# Altium schematic sheet SC.schdoc: TEBF0808 - CPLD
size A4; DocumentNumber: TEBF0808; Revision: 04; SheetNumber: 26; SheetTotal: 36; Date: 2016-09-29; CompanyName: Trenz Electronic GmbH; Organization: Trenz Electronic GmbH
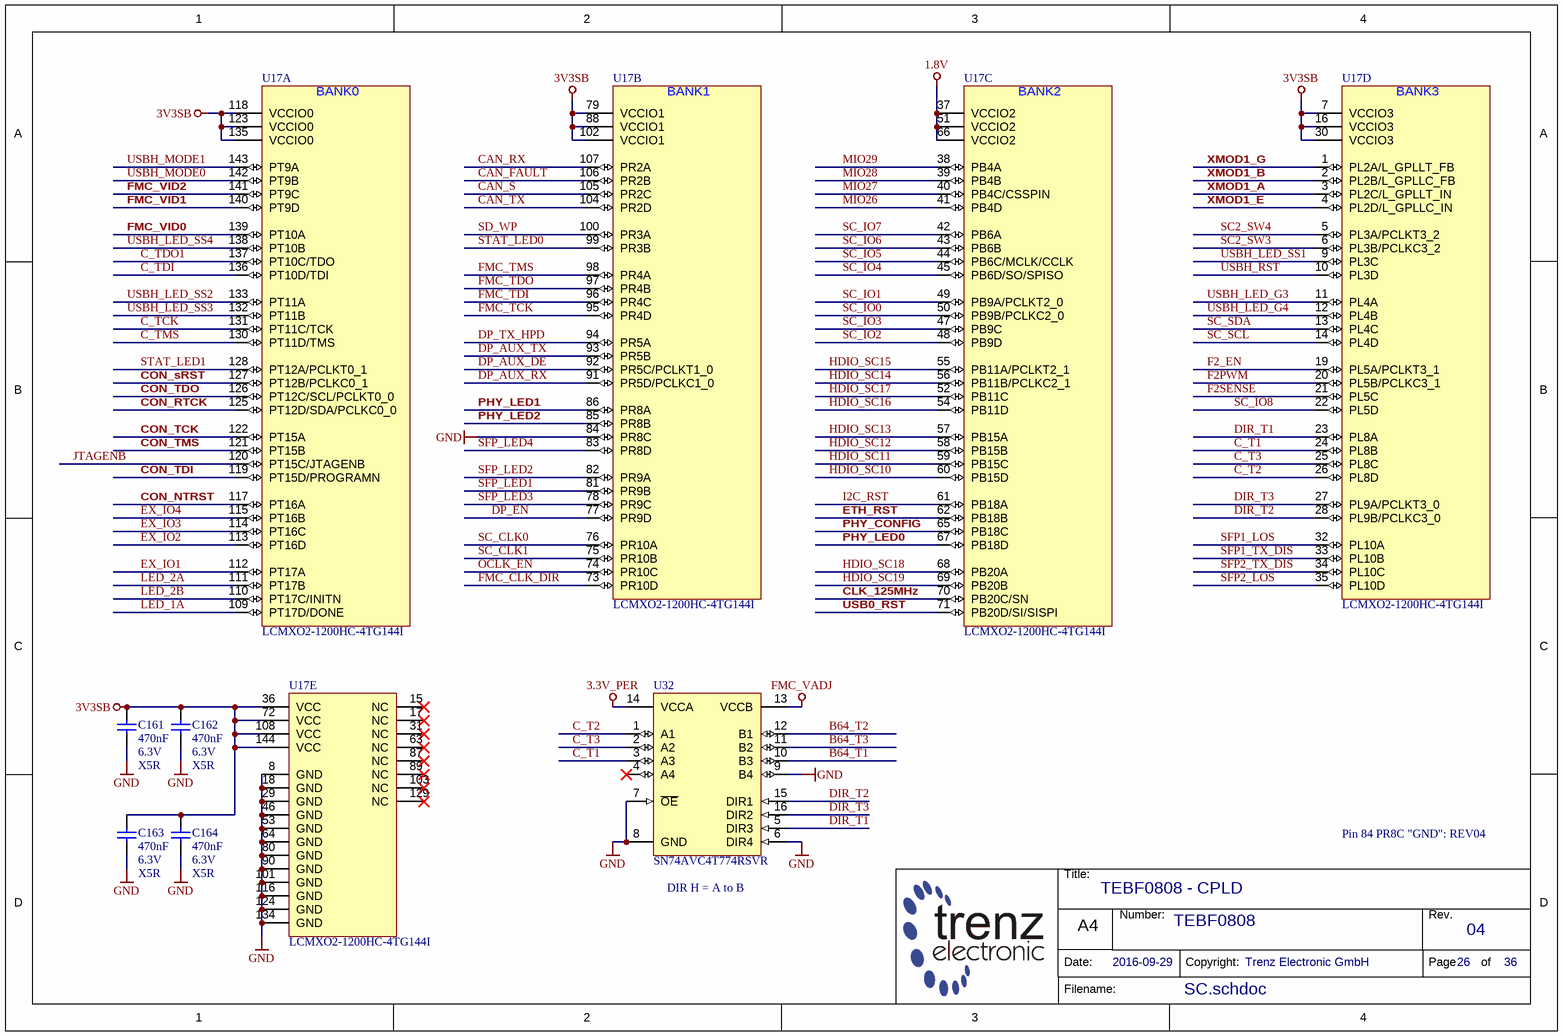
[diagram p0: SC.schdoc]

## Parts
C161  470nF  Voltage: 6.3V  Technology: X5R  [CAPC1005X55N]
C162  470nF  Voltage: 6.3V  Technology: X5R  [CAPC1005X55N]
C163  470nF  Voltage: 6.3V  Technology: X5R  [CAPC1005X55N]
C164  470nF  Voltage: 6.3V  Technology: X5R  [CAPC1005X55N]
U17  LCMXO2-1200HC-4TG144I  [QFP50P2200X2200X160-144N]  (parts A,B,C,D,E of 5)
U32  SN74AVC4T774RSVR  [QFN40P260X180X55-16N]

## Nets
1.8V: U17.37(VCCIO2) U17.51(VCCIO2) U17.66(VCCIO2)
3.3V_PER: U32.14(VCCA)
3V3SB: C161.1 C162.1 C163.1 C164.1 U17.7(VCCIO3) U17.16(VCCIO3) U17.30(VCCIO3) U17.36(VCC) U17.72(VCC) U17.79(VCCIO1) U17.88(VCCIO1) U17.102(VCCIO1) U17.108(VCC) U17.118(VCCIO0) U17.123(VCCIO0) U17.135(VCCIO0) U17.144(VCC)
FMC_VADJ: U32.13(VCCB)
GND: C161.2 C162.2 C163.2 C164.2 U17.8(GND) U17.18(GND) U17.29(GND) U17.46(GND) U17.53(GND) U17.64(GND) U17.80(GND) U17.84(PR8C) U17.90(GND) U17.101(GND) U17.116(GND) U17.124(GND) U17.134(GND) U32.6(DIR4) U32.7(~{OE}) U32.8(GND) U32.9(B4)
B64_T1: U32.10(B3)
B64_T2: U32.12(B1)
B64_T3: U32.11(B2)
C_T1: U17.24(PL8B) U32.3(A3)
C_T2: U17.26(PL8D) U32.1(A1)
C_T3: U17.25(PL8C) U32.2(A2)
C_TCK: U17.131(PT11C/TCK)
C_TDI: U17.136(PT10D/TDI)
C_TDO1: U17.137(PT10C/TDO)
C_TMS: U17.130(PT11D/TMS)
CAN_FAULT: U17.106(PR2B)
CAN_RX: U17.107(PR2A)
CAN_S: U17.105(PR2C)
CAN_TX: U17.104(PR2D)
CLK_125MHz: U17.70(PB20C/SN)
CON_NTRST: U17.117(PT16A)
CON_RTCK: U17.125(PT12D/SDA/PCLKC0_0)
CON_sRST: U17.127(PT12B/PCLKC0_1)
CON_TCK: U17.122(PT15A)
CON_TDI: U17.119(PT15D/PROGRAMN)
CON_TDO: U17.126(PT12C/SCL/PCLKT0_0)
CON_TMS: U17.121(PT15B)
DIR_T1: U17.23(PL8A) U32.5(DIR3)
DIR_T2: U17.28(PL9B/PCLKC3_0) U32.15(DIR1)
DIR_T3: U17.27(PL9A/PCLKT3_0) U32.16(DIR2)
DP_AUX_DE: U17.92(PR5C/PCLKT1_0)
DP_AUX_RX: U17.91(PR5D/PCLKC1_0)
DP_AUX_TX: U17.93(PR5B)
DP_EN: U17.77(PR9D)
DP_TX_HPD: U17.94(PR5A)
ETH_RST: U17.62(PB18B)
EX_IO1: U17.112(PT17A)
EX_IO2: U17.113(PT16D)
EX_IO3: U17.114(PT16C)
EX_IO4: U17.115(PT16B)
F2_EN: U17.19(PL5A/PCLKT3_1)
F2PWM: U17.20(PL5B/PCLKC3_1)
F2SENSE: U17.21(PL5C)
FMC_CLK_DIR: U17.73(PR10D)
FMC_TCK: U17.95(PR4D)
FMC_TDI: U17.96(PR4C)
FMC_TDO: U17.97(PR4B)
FMC_TMS: U17.98(PR4A)
FMC_VID0: U17.139(PT10A)
FMC_VID1: U17.140(PT9D)
FMC_VID2: U17.141(PT9C)
HDIO_SC10: U17.60(PB15D)
HDIO_SC11: U17.59(PB15C)
HDIO_SC12: U17.58(PB15B)
HDIO_SC13: U17.57(PB15A)
HDIO_SC14: U17.56(PB11B/PCLKC2_1)
HDIO_SC15: U17.55(PB11A/PCLKT2_1)
HDIO_SC16: U17.54(PB11D)
HDIO_SC17: U17.52(PB11C)
HDIO_SC18: U17.68(PB20A)
HDIO_SC19: U17.69(PB20B)
I2C_RST: U17.61(PB18A)
JTAGENB: U17.120(PT15C/JTAGENB)
LED_1A: U17.109(PT17D/DONE)
LED_2A: U17.111(PT17B)
LED_2B: U17.110(PT17C/INITN)
MIO26: U17.41(PB4D)
MIO27: U17.40(PB4C/CSSPIN)
MIO28: U17.39(PB4B)
MIO29: U17.38(PB4A)
OCLK_EN: U17.74(PR10C)
PHY_CONFIG: U17.65(PB18C)
PHY_LED0: U17.67(PB18D)
PHY_LED1: U17.86(PR8A)
PHY_LED2: U17.85(PR8B)
SC2_SW3: U17.6(PL3B/PCLKC3_2)
SC2_SW4: U17.5(PL3A/PCLKT3_2)
SC_CLK0: U17.76(PR10A)
SC_CLK1: U17.75(PR10B)
SC_IO0: U17.50(PB9B/PCLKC2_0)
SC_IO1: U17.49(PB9A/PCLKT2_0)
SC_IO2: U17.48(PB9D)
SC_IO3: U17.47(PB9C)
SC_IO4: U17.45(PB6D/SO/SPISO)
SC_IO5: U17.44(PB6C/MCLK/CCLK)
SC_IO6: U17.43(PB6B)
SC_IO7: U17.42(PB6A)
SC_IO8: U17.22(PL5D)
SC_SCL: U17.14(PL4D)
SC_SDA: U17.13(PL4C)
SD_WP: U17.100(PR3A)
SFP1_LOS: U17.32(PL10A)
SFP1_TX_DIS: U17.33(PL10B)
SFP2_LOS: U17.35(PL10D)
SFP2_TX_DIS: U17.34(PL10C)
SFP_LED1: U17.81(PR9B)
SFP_LED2: U17.82(PR9A)
SFP_LED3: U17.78(PR9C)
SFP_LED4: U17.83(PR8D)
STAT_LED0: U17.99(PR3B)
STAT_LED1: U17.128(PT12A/PCLKT0_1)
USB0_RST: U17.71(PB20D/SI/SISPI)
USBH_LED_G3: U17.11(PL4A)
USBH_LED_G4: U17.12(PL4B)
USBH_LED_SS1: U17.9(PL3C)
USBH_LED_SS2: U17.133(PT11A)
USBH_LED_SS3: U17.132(PT11B)
USBH_LED_SS4: U17.138(PT10B)
USBH_MODE0: U17.142(PT9B)
USBH_MODE1: U17.143(PT9A)
USBH_RST: U17.10(PL3D)
XMOD1_A: U17.3(PL2C/L_GPLLT_IN)
XMOD1_B: U17.2(PL2B/L_GPLLC_FB)
XMOD1_E: U17.4(PL2D/L_GPLLC_IN)
XMOD1_G: U17.1(PL2A/L_GPLLT_FB)

Not connected (* = marked no-connect by the designer): U17 15(NC)* 17(NC)* 31(NC)* 63(NC)* 87(NC)* 89(NC)* 103(NC)* 129(NC)*; U32 4(A4)*

## Notes on the sheet
- Pin 84 PR8C "GND": REV04
- (near U32) DIR H = A to B
- Title:
- Number:
- Rev.
- Date:
- A4
- Copyright:
- Page
- of
- Filename:
- (in symbol 25915, part A) BANK0
- (in symbol 25915, part B) BANK1
- (in symbol 25915, part C) BANK2
- (in symbol 25915, part D) BANK3

## Library data of the parts
C161-C164 = 23659: KON 470nF 6,3V X5R SMD; AN: 23659; Mixed: SMT; Value: 470n; Preferred: Yes; Case: 1005 (0402)
U17 = 25915: AN: 25915; Mixed: SMT; Trenz-Stock: Yes; Case: TQFP144; HelpURL: B:\AD\adlib\datasheet\MachXO2; H-ART: LCMXO2-1200HC-4TG144I
U32 = 27170: AN: 27170; Mixed: SMT; Trenz-Stock: Yes; Case: UQFN-16; HelpURL: B:\ad\adlib\datasheet\sn74avc4t774; H-ART: SN74AVC4T774RSVR